# Altium schematic sheet XMOS.SchDoc: xcore.ai Multi Channel Audio
size 408 x 287 mm; DocumentNumber: 2; Revision: 1V1; SheetNumber: 2; SheetTotal: 8
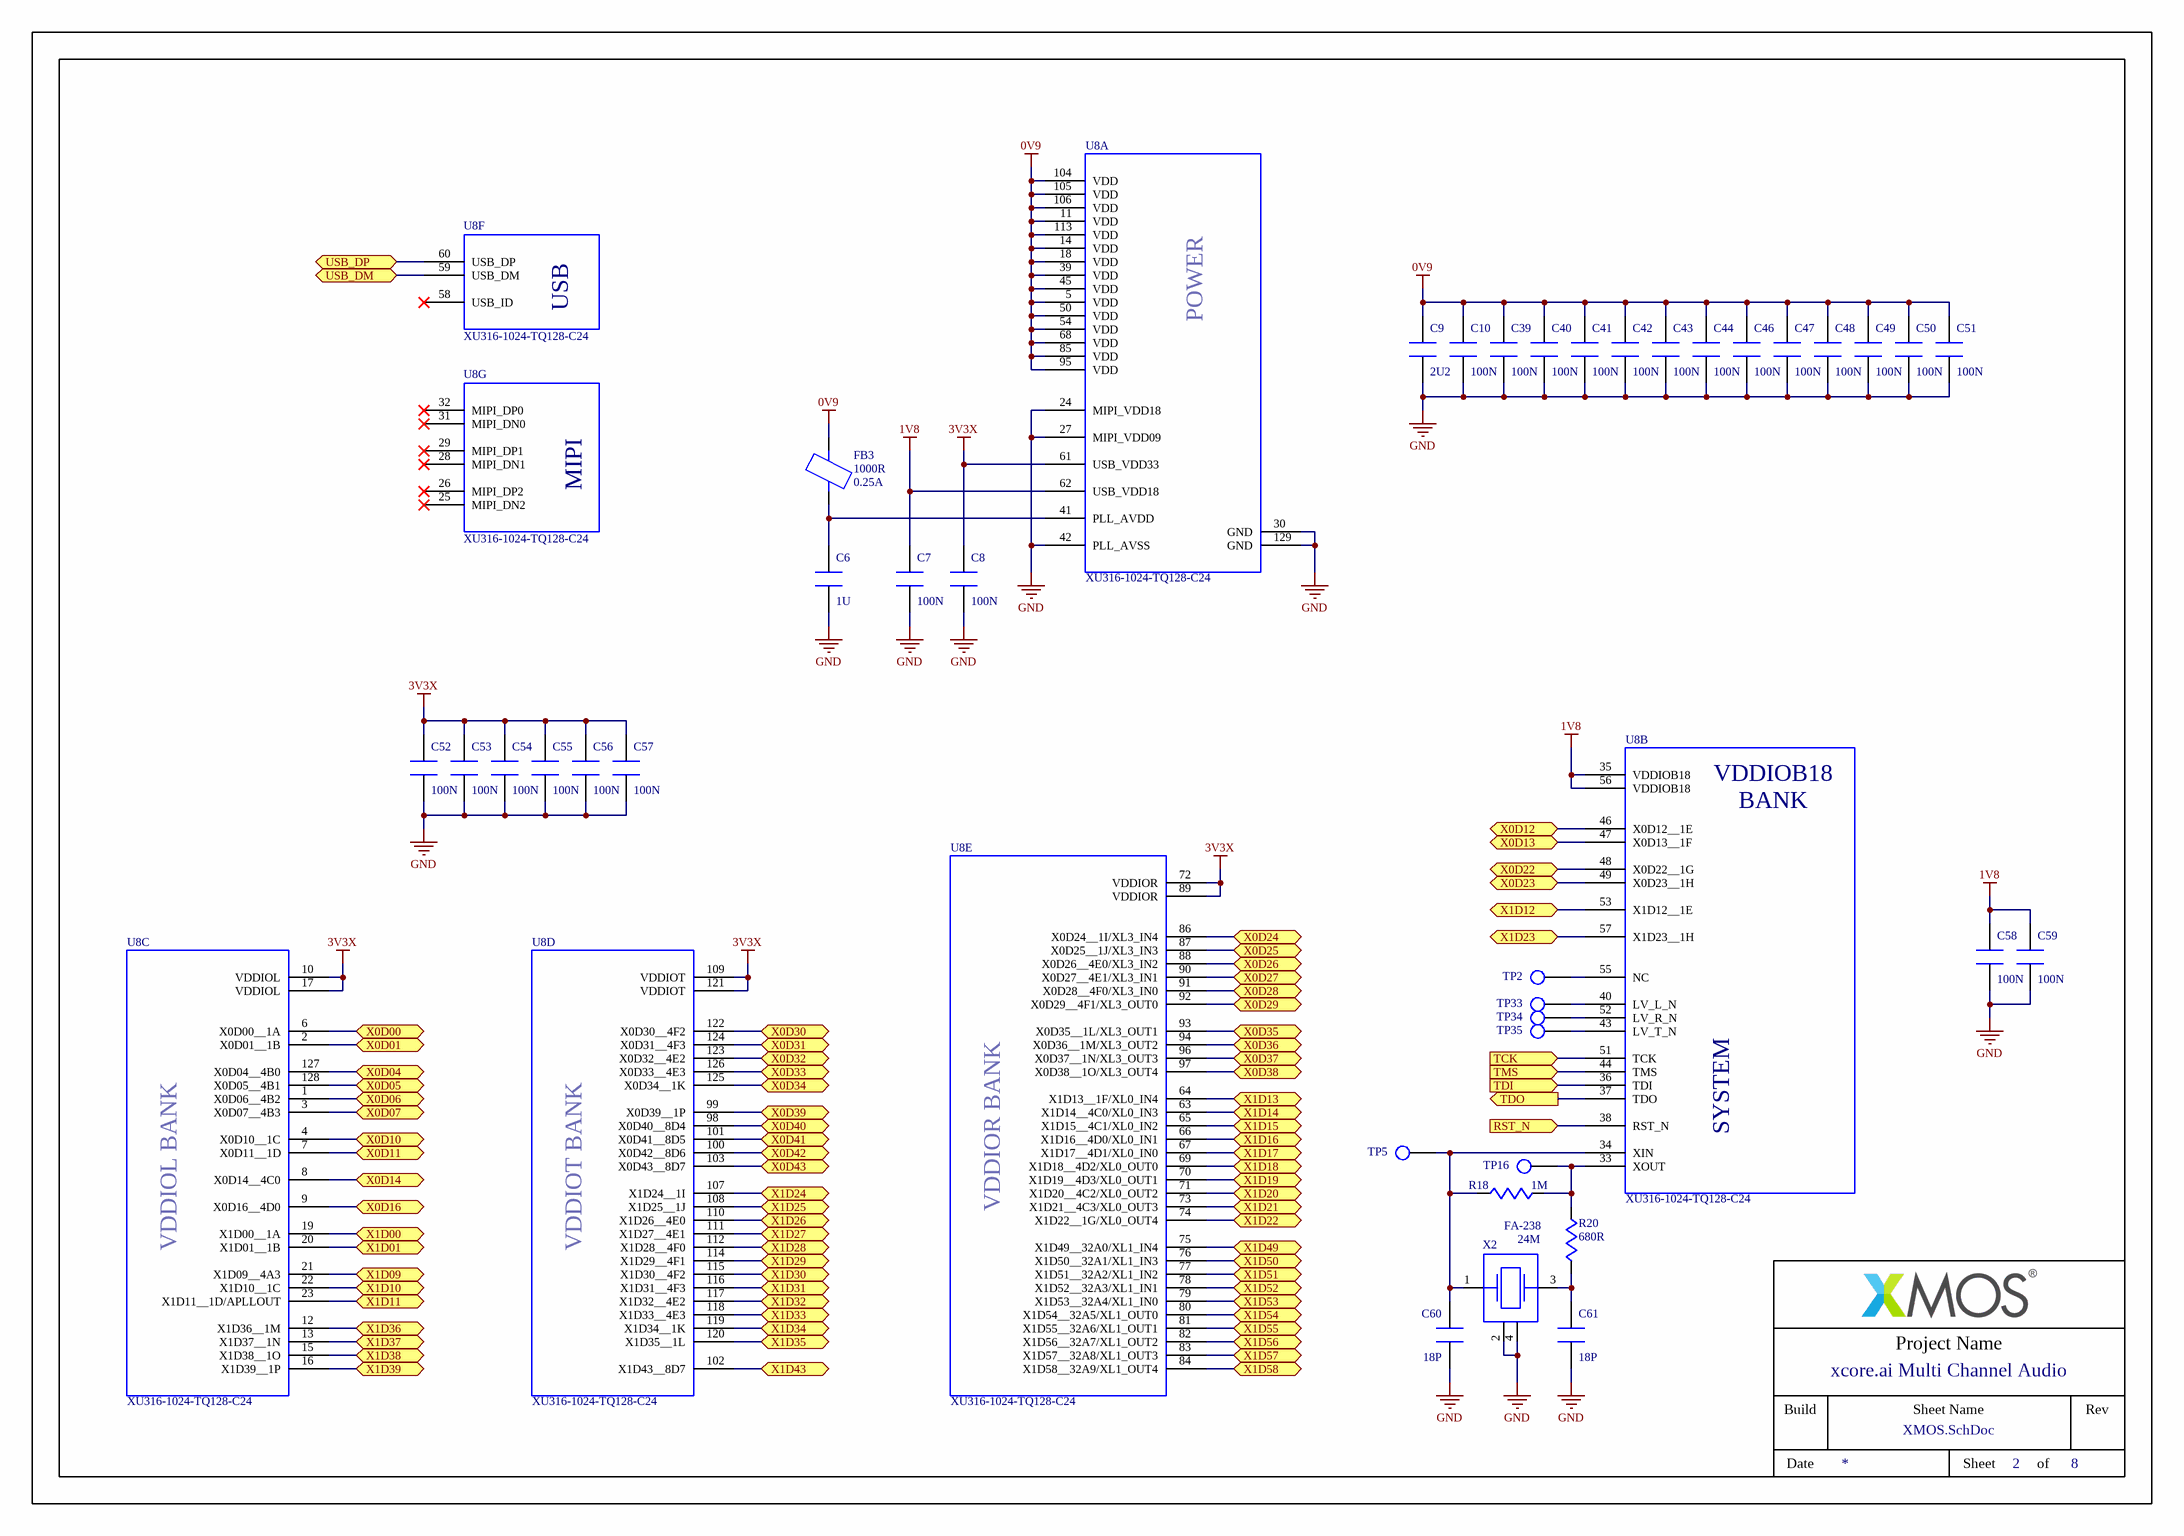
[diagram p0: XMOS.SchDoc]

## Parts
C6  1U  [CAPC1005X55N]
C7  100N  [CAPC1005X55N]
C8  100N  [CAPC1005X55N]
C9  2U2  [CAPC1005X55N]
C10  100N  [CAPC1005X55N]
C39  100N  [CAPC1005X55N]
C40  100N  [CAPC1005X55N]
C41  100N  [CAPC1005X55N]
C42  100N  [CAPC1005X55N]
C43  100N  [CAPC1005X55N]
C44  100N  [CAPC1005X55N]
C46  100N  [CAPC1005X55N]
C47  100N  [CAPC1005X55N]
C48  100N  [CAPC1005X55N]
C49  100N  [CAPC1005X55N]
C50  100N  [CAPC1005X55N]
C51  100N  [CAPC1005X55N]
C52  100N  [CAPC1005X55N]
C53  100N  [CAPC1005X55N]
C54  100N  [CAPC1005X55N]
C55  100N  [CAPC1005X55N]
C56  100N  [CAPC1005X55N]
C57  100N  [CAPC1005X55N]
C58  100N  [CAPC1005X55N]
C59  100N  [CAPC1005X55N]
C60  18P  [CAPC1005X55N]
C61  18P  [CAPC1005X55N]
FB3  1000R  Rated Current: 0.25A  [INDC1005X55N]
R18  1M  [RESC1608X55N]
R20  680R  [RESC1608X55N]
TP2  TESTPOINT  [TESTPOINT_SMD_0.9MM_L]  (value not drawn)  (no BOM)
TP5  TESTPOINT  [TESTPOINT_SMD_0.9MM_L]  (value not drawn)  (no BOM)
TP16  TESTPOINT  [TESTPOINT_SMD_0.9MM_L]  (value not drawn)  (no BOM)
TP33  TESTPOINT  [TESTPOINT_SMD_0.9MM_L]  (value not drawn)  (no BOM)
TP34  TESTPOINT  [TESTPOINT_SMD_0.9MM_L]  (value not drawn)  (no BOM)
TP35  TESTPOINT  [TESTPOINT_SMD_0.9MM_L]  (value not drawn)  (no BOM)
U8  XU316-1024-TQ128-C24  [QFP40P1600X1600X120-129_T480N]  (parts A,B,C,D,E,F,G of 7)
X2  FA-238  FREQUENCY: 24M  [OSCCC320X250X120N]

## Ports
RST_N (in), TCK (in), TDI (in), TDO (out), TMS (in), USB_DM (bidir), USB_DP (bidir), X0D00 (bidir), X0D01 (bidir), X0D04 (bidir), X0D05 (bidir), X0D06 (bidir), X0D07 (bidir), X0D10 (bidir), X0D11 (bidir), X0D12 (bidir), X0D13 (bidir), X0D14 (bidir), X0D16 (bidir), X0D22 (bidir), X0D23 (bidir), X0D24 (bidir), X0D25 (bidir), X0D26 (bidir), X0D27 (bidir), X0D28 (bidir), X0D29 (bidir), X0D30 (bidir), X0D31 (bidir), X0D32 (bidir), X0D33 (bidir), X0D34 (bidir), X0D35 (bidir), X0D36 (bidir), X0D37 (bidir), X0D38 (bidir), X0D39 (bidir), X0D40 (bidir), X0D41 (bidir), X0D42 (bidir), X0D43 (bidir), X1D00 (bidir), X1D01 (bidir), X1D09 (bidir), X1D10 (bidir), X1D11 (bidir), X1D12 (bidir), X1D13 (bidir), X1D14 (bidir), X1D15 (bidir), X1D16 (bidir), X1D17 (bidir), X1D18 (bidir), X1D19 (bidir), X1D20 (bidir), X1D21 (bidir), X1D22 (bidir), X1D23 (bidir), X1D24 (bidir), X1D25 (bidir), X1D26 (bidir), X1D27 (bidir), X1D28 (bidir), X1D29 (bidir), X1D30 (bidir), X1D31 (bidir), X1D32 (bidir), X1D33 (bidir), X1D34 (bidir), X1D35 (bidir), X1D36 (bidir), X1D37 (bidir), X1D38 (bidir), X1D39 (bidir), X1D43 (bidir), X1D49 (bidir), X1D50 (bidir), X1D51 (bidir), X1D52 (bidir), X1D53 (bidir), X1D54 (bidir), X1D55 (bidir), X1D56 (bidir), X1D57 (bidir), X1D58 (bidir)

## Nets
0V9: C9.1 C10.1 C39.1 C40.1 C41.1 C42.1 C43.1 C44.1 C46.1 C47.1 C48.1 C49.1 C50.1 C51.1 FB3.2 U8.5(VDD) U8.11(VDD) U8.14(VDD) U8.18(VDD) U8.39(VDD) U8.45(VDD) U8.50(VDD) U8.54(VDD) U8.68(VDD) U8.85(VDD) U8.95(VDD) U8.104(VDD) U8.105(VDD) U8.106(VDD) U8.113(VDD)
1V8: C7.1 C58.1 C59.1 U8.35(VDDIOB18) U8.56(VDDIOB18) U8.62(USB_VDD18)
3V3X: C8.1 C52.1 C53.1 C54.1 C55.1 C56.1 C57.1 U8.10(VDDIOL) U8.17(VDDIOL) U8.61(USB_VDD33) U8.72(VDDIOR) U8.89(VDDIOR) U8.109(VDDIOT) U8.121(VDDIOT)
GND: C6.2 C7.2 C8.2 C9.2 C10.2 C39.2 C40.2 C41.2 C42.2 C43.2 C44.2 C46.2 C47.2 C48.2 C49.2 C50.2 C51.2 C52.2 C53.2 C54.2 C55.2 C56.2 C57.2 C58.2 C59.2 C60.2 C61.2 U8.24(MIPI_VDD18) U8.27(MIPI_VDD09) U8.30(GND) U8.42(PLL_AVSS) U8.129(GND) X2.2(CASE_2) X2.4(CASE_4)
RST_N: U8.38(RST_N) ; port RST_N
TCK: U8.51(TCK) ; port TCK
TDI: U8.36(TDI) ; port TDI
TDO: U8.37(TDO) ; port TDO
TMS: U8.44(TMS) ; port TMS
USB_DM: U8.59(USB_DM) ; port USB_DM
USB_DP: U8.60(USB_DP) ; port USB_DP
X0D00: U8.6(X0D00__1A) ; port X0D00
X0D01: U8.2(X0D01__1B) ; port X0D01
X0D04: U8.127(X0D04__4B0) ; port X0D04
X0D05: U8.128(X0D05__4B1) ; port X0D05
X0D06: U8.1(X0D06__4B2) ; port X0D06
X0D07: U8.3(X0D07__4B3) ; port X0D07
X0D10: U8.4(X0D10__1C) ; port X0D10
X0D11: U8.7(X0D11__1D) ; port X0D11
X0D12: U8.46(X0D12__1E) ; port X0D12
X0D13: U8.47(X0D13__1F) ; port X0D13
X0D14: U8.8(X0D14__4C0) ; port X0D14
X0D16: U8.9(X0D16__4D0) ; port X0D16
X0D22: U8.48(X0D22__1G) ; port X0D22
X0D23: U8.49(X0D23__1H) ; port X0D23
X0D24: U8.86(X0D24__1I/XL3_IN4) ; port X0D24
X0D25: U8.87(X0D25__1J/XL3_IN3) ; port X0D25
X0D26: U8.88(X0D26__4E0/XL3_IN2) ; port X0D26
X0D27: U8.90(X0D27__4E1/XL3_IN1) ; port X0D27
X0D28: U8.91(X0D28__4F0/XL3_IN0) ; port X0D28
X0D29: U8.92(X0D29__4F1/XL3_OUT0) ; port X0D29
X0D30: U8.122(X0D30__4F2) ; port X0D30
X0D31: U8.124(X0D31__4F3) ; port X0D31
X0D32: U8.123(X0D32__4E2) ; port X0D32
X0D33: U8.126(X0D33__4E3) ; port X0D33
X0D34: U8.125(X0D34__1K) ; port X0D34
X0D35: U8.93(X0D35__1L/XL3_OUT1) ; port X0D35
X0D36: U8.94(X0D36__1M/XL3_OUT2) ; port X0D36
X0D37: U8.96(X0D37__1N/XL3_OUT3) ; port X0D37
X0D38: U8.97(X0D38__1O/XL3_OUT4) ; port X0D38
X0D39: U8.99(X0D39__1P) ; port X0D39
X0D40: U8.98(X0D40__8D4) ; port X0D40
X0D41: U8.101(X0D41__8D5) ; port X0D41
X0D42: U8.100(X0D42__8D6) ; port X0D42
X0D43: U8.103(X0D43__8D7) ; port X0D43
X1D00: U8.19(X1D00__1A) ; port X1D00
X1D01: U8.20(X1D01__1B) ; port X1D01
X1D09: U8.21(X1D09__4A3) ; port X1D09
X1D10: U8.22(X1D10__1C) ; port X1D10
X1D11: U8.23(X1D11__1D/APLLOUT) ; port X1D11
X1D12: U8.53(X1D12__1E) ; port X1D12
X1D13: U8.64(X1D13__1F/XL0_IN4) ; port X1D13
X1D14: U8.63(X1D14__4C0/XL0_IN3) ; port X1D14
X1D15: U8.65(X1D15__4C1/XL0_IN2) ; port X1D15
X1D16: U8.66(X1D16__4D0/XL0_IN1) ; port X1D16
X1D17: U8.67(X1D17__4D1/XL0_IN0) ; port X1D17
X1D18: U8.69(X1D18__4D2/XL0_OUT0) ; port X1D18
X1D19: U8.70(X1D19__4D3/XL0_OUT1) ; port X1D19
X1D20: U8.71(X1D20__4C2/XL0_OUT2) ; port X1D20
X1D21: U8.73(X1D21__4C3/XL0_OUT3) ; port X1D21
X1D22: U8.74(X1D22__1G/XL0_OUT4) ; port X1D22
X1D23: U8.57(X1D23__1H) ; port X1D23
X1D24: U8.107(X1D24__1I) ; port X1D24
X1D25: U8.108(X1D25__1J) ; port X1D25
X1D26: U8.110(X1D26__4E0) ; port X1D26
X1D27: U8.111(X1D27__4E1) ; port X1D27
X1D28: U8.112(X1D28__4F0) ; port X1D28
X1D29: U8.114(X1D29__4F1) ; port X1D29
X1D30: U8.115(X1D30__4F2) ; port X1D30
X1D31: U8.116(X1D31__4F3) ; port X1D31
X1D32: U8.117(X1D32__4E2) ; port X1D32
X1D33: U8.118(X1D33__4E3) ; port X1D33
X1D34: U8.119(X1D34__1K) ; port X1D34
X1D35: U8.120(X1D35__1L) ; port X1D35
X1D36: U8.12(X1D36__1M) ; port X1D36
X1D37: U8.13(X1D37__1N) ; port X1D37
X1D38: U8.15(X1D38__1O) ; port X1D38
X1D39: U8.16(X1D39__1P) ; port X1D39
X1D43: U8.102(X1D43__8D7) ; port X1D43
X1D49: U8.75(X1D49__32A0/XL1_IN4) ; port X1D49
X1D50: U8.76(X1D50__32A1/XL1_IN3) ; port X1D50
X1D51: U8.77(X1D51__32A2/XL1_IN2) ; port X1D51
X1D52: U8.78(X1D52__32A3/XL1_IN1) ; port X1D52
X1D53: U8.79(X1D53__32A4/XL1_IN0) ; port X1D53
X1D54: U8.80(X1D54__32A5/XL1_OUT0) ; port X1D54
X1D55: U8.81(X1D55__32A6/XL1_OUT1) ; port X1D55
X1D56: U8.82(X1D56__32A7/XL1_OUT2) ; port X1D56
X1D57: U8.83(X1D57__32A8/XL1_OUT3) ; port X1D57
X1D58: U8.84(X1D58__32A9/XL1_OUT4) ; port X1D58
NetC6_1: C6.1 FB3.1 U8.41(PLL_AVDD)
NetC60_1: C60.1 R18.1 TP5.1 U8.34(XIN) X2.1(A)
NetC61_1: C61.1 R20.1 X2.3(B)
NetR18_2: R18.2 R20.2 TP16.1 U8.33(XOUT)
NetTP2_1: TP2.1 U8.55(NC)
NetTP33_1: TP33.1 U8.40(LV_L_N)
NetTP34_1: TP34.1 U8.52(LV_R_N)
NetTP35_1: TP35.1 U8.43(LV_T_N)

Not connected (* = marked no-connect by the designer): U8 25(MIPI_DN2)* 26(MIPI_DP2)* 28(MIPI_DN1)* 29(MIPI_DP1)* 31(MIPI_DN0)* 32(MIPI_DP0)* 58(USB_ID)*

## Notes on the sheet
- Project Name
- Build
- Sheet Name
- Rev
- Date
- Sheet
- of
- (in symbol GEN-08-0039, part A) POWER
- (in symbol GEN-08-0039, part B) BANK; SYSTEM
- (in symbol GEN-08-0039, part C) VDDIOL BANK
- (in symbol GEN-08-0039, part D) VDDIOT BANK
- (in symbol GEN-08-0039, part E) VDDIOR BANK
- (in symbol GEN-08-0039, part F) USB
- (in symbol GEN-08-0039, part G) MIPI

## Library data of the parts
C6 = STD-06-0140: CHIP CAPACITOR, CERAMIC, 1.0UF, 16V, 10%, X5R, 0402; Manufacturer: Murata; Manufacturer Part Number: GRM155R61C105MA12D; Tolerance: 20%; Approx Volume Cost ($): 0.011; VALUE: 1U; Part Number: STD-06-0140; Dielectric: X5R; Rated Voltage: 16V; Web Search Link: http://www.google.com/search?q=GRM155R61C105MA12D
C7 C8 C10 C39-C44 C46-C59 = STD-06-0048: CHIP CAPACITOR, CERAMIC, 100NF, 16V, 10%, X7R, 0402; Manufacturer: Yageo; Manufacturer Part Number: CC0402KRX7R7BB104; Approx Volume Cost ($): 0.003; VALUE: 100N; Part Number: STD-06-0048; Dielectric: X7R; Rated Voltage: 16V; Tolerance: 10%
  C7 C8: Web Search Link: http://www.google.com/search?q=CC0402KRX7R7BB104
C9 = GEN-03-0029: CHIP CAPACITOR, CERAMIC, 2.2UF, 6.3V, 10%, X5R, 0402; Manufacturer: AVX; Manufacturer Part Number: 04026D225KAT2A; Approx Volume Cost ($): 0.015; VALUE: 2U2; Part Number: GEN-03-0029; Dielectric: X5R; Rated Voltage: 6.3V; Tolerance: 10%
C60 C61 = STD-06-0016: CHIP CAPACITOR, CERAMIC, 18PF, 50V, 5%, NP0, 0402; Manufacturer: Yageo; Manufacturer Part Number: CC0402JRNPO9BN180; Approx Volume Cost ($): 0.003; VALUE: 18P; Part Number: STD-06-0016; Dielectric: NP0; Rated Voltage: 50V; Tolerance: 5%; Web Search Link: http://www.google.com/search?q=CC0402JRNPO9BN180
FB3 = GEN-04-0019: Ferrite Bead, 1000R AT 100MHz, For Signal Lines, 0402, 0.25A; Manufacturer: Murata; Manufacturer Part Number: BLM15HD102SN1; Max DCR: 1.25R; Approx Volume Cost ($): 0.018; VALUE: 1000R; Part Number: GEN-04-0019; Web Search Link: http://www.google.com/search?q=BLM15HD102SN1
R18 = STD-02-0134: CHIP RESISTOR, 1.0M OHM, 0.1W, 5%, 0603; Manufacturer: Yageo; Manufacturer Part Number: RC0603JR-071ML; Max Voltage: 50V; Max Power: 100mW; Temperature Coefficient: ±100ppm/°C; Approx Volume Cost ($): 0.002; VALUE: 1M; Part Number: STD-02-0134; Tolerance: 5%
R20 = STD-02-0058: CHIP RESISTOR, 680 OHM, 0.1W, 1%, 0603; Manufacturer: Yageo; Manufacturer Part Number: RC0603FR-07680RL; Max Voltage: 50V; Max Power: 100mW; Temperature Coefficient: ±100ppm/°C; Approx Volume Cost ($): 0.002; VALUE: 680R; Part Number: STD-02-0058; Tolerance: 1%
TP2 TP5 TP16 TP33-TP35 = GEN-24-0019: Testpoint, SMD, 0.9mm; Manufacturer: NA; VALUE: TESTPOINT; Part Number: GEN-24-0019; Manufacturer Part Number: NA; Approx Volume Cost ($): NA
U8 = GEN-08-0039: Processor, xcore.ai, 2400MIPS, 128TQFP; Manufacturer: XMOS; Approx Volume Cost ($): 5; VALUE: XU316-1024-TQ128-C24; Part Number: GEN-08-0039; Manufacturer Part Number: XU316-1024-TQ128-C24; Web Search Link: http://www.google.com/search?q=XU316-1024-TQ128
X2 = GEN-15-0032: Crystal, 24MHz, Freq Tol. ±30ppm, Freq Stab. ±30ppm, CL 12pF, 3.2x2.5mm SMD; Manufacturer: Seiko Epson; Manufacturer Part Number: FA-238 24.0000MD30X-W; Approx Volume Cost ($): 0.15; VALUE: FA-238; Part Number: GEN-15-0032; Web Search Link: http://www.google.com/search?q=FA-238 24.0000MD30X-W